# EAGLE design INA226 (EAGLE 7.1.0)
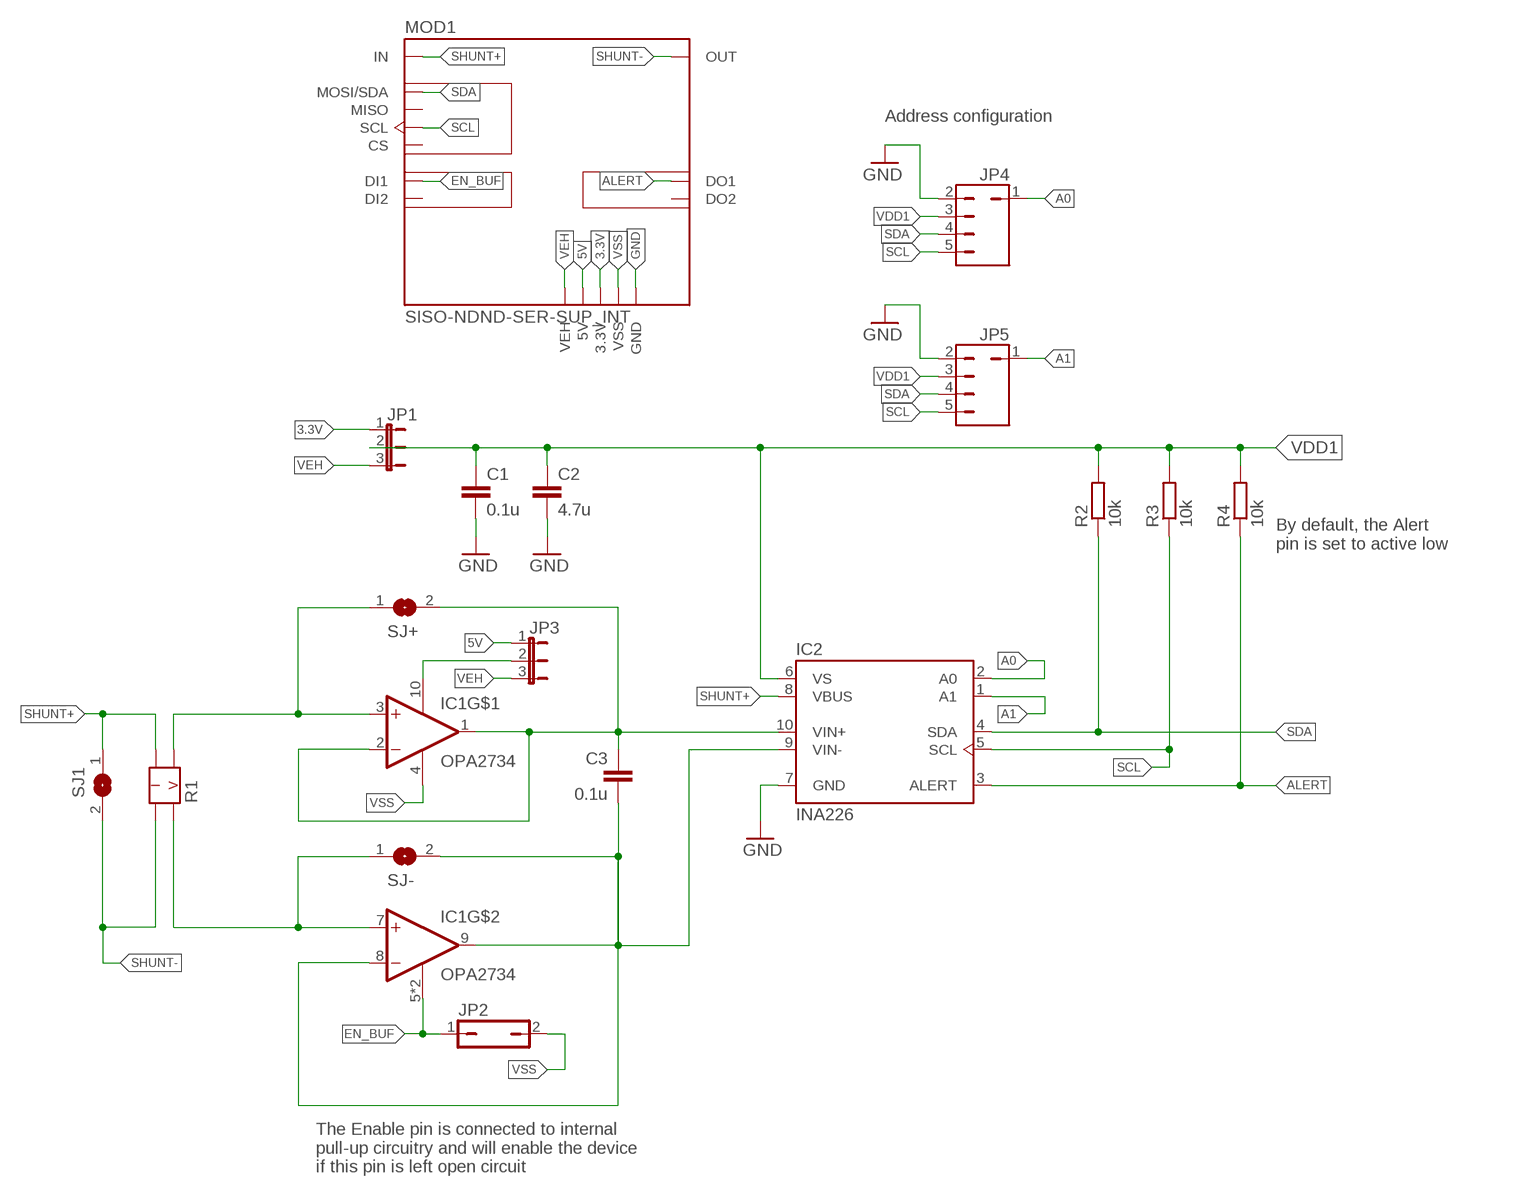
[diagram p0: schematic, sheet 1]

## Parts
C1  0.1u  C-EUC0805K  [C0805K]
C2  4.7u  C-EUC1206K  [C1206K]
C3  0.1u  C-EUC0805K  [C0805K]
IC1  OPA2734  [MSOP10]
IC2  INA226  [DGS10]
JP1  JP2E  [JP2]
JP2  JP1Q  [JP1]
JP3  JP2E  [JP2]
JP4  JP3Q  [JP1-4]
JP5  JP3Q  [JP1-4]
MOD1  SISO-NDND-SER-SUP_INT  [SISO-NDND-SER-SUP]
R1  LVK_SERIESR1206  [LVK12]
R2  10k  R-EU_R0805  [R0805]
R3  10k  R-EU_R0805  [R0805]
R4  10k  R-EU_R0805  [R0805]
SJ1  SJ  [SJ]
SJ+  SJ2  [SJ2]
SJ-  SJ2  [SJ2]

## Nets
3.3V: JP1.1 MOD1.3.3V
5V: JP3.1 MOD1.5V
A0: IC2.2(A0) JP4.1
A1: IC2.1(A1) JP5.1
ALERT: IC2.3(ALERT) MOD1.DO1 R4.1
EN_BUF: IC1.5(EN$1) IC1.6(EN$1) JP2.1 MOD1.DI1
GND: C1.2 C2.2 IC2.7(GND) JP4.2 JP5.2 MOD1.GND1(GND) MOD1.GND2(GND) MOD1.GND3(GND) MOD1.GND4(GND)
N$2: IC1.3(+IN) R1.V2 SJ+.1
N$4: IC1.10(V+) JP3.2
N$7: IC1.7(+IN) R1.V1 SJ-.1
OUT_A: C3.1 IC1.1(OUT) IC1.2(-IN) IC2.10(VIN+) SJ+.2
OUT_B: C3.2 IC1.8(-IN) IC1.9(OUT) IC2.9(VIN-) SJ-.2
SCL: IC2.5(SCL) JP4.5 JP5.5 MOD1.SCL R3.1
SDA: IC2.4(SDA) JP4.4 JP5.4 MOD1.MOSI/SDA R2.1
SHUNT+: IC2.8(VBUS) MOD1.IN1(IN) MOD1.IN2(IN) MOD1.IN3(IN) MOD1.IN4(IN) R1.I2 SJ1.1
SHUNT-: MOD1.OUT1(OUT) MOD1.OUT2(OUT) MOD1.OUT3(OUT) MOD1.OUT4(OUT) R1.I1 SJ1.2
VDD1: C1.1 C2.1 IC2.6(VS) JP1.2 JP4.3 JP5.3 R2.2 R3.2 R4.2
VEH: JP1.3 JP3.3 MOD1.VEH
VSS: IC1.4(V-) JP2.2 MOD1.VSS
Unconnected: MOD1.CS MOD1.DI2 MOD1.DO2 MOD1.MISO

## Notes on the sheet
- Address configuration
- By default, the Alert
  pin is set to active low
- The Enable pin is connected to internal
  pull-up circuitry and will enable the device
  if this pin is left open circuit

## Library data of the parts
C1-C3 = rcl:C-EU: CAPACITOR, European symbol
IC1 = OPA2734:OPA2734
IC2 = INA226:INA226
JP1 JP3 = Jumper_mod:JP2E: JUMPER
JP2 = jumper:JP1Q: JUMPER
JP4 JP5 = Jumper_mod:JP3Q: JUMPER
MOD1 = AllModules:SISO-NDND-SER-SUP_INT
R1 = LVK_Series:LVK_SERIES: RESISTOR, European symbol; SPICEPREFIX: R
R2-R4 = rcl:R-EU_: RESISTOR, European symbol
SJ1 = jumper:SJ: SMD solder JUMPER
SJ+ SJ- = Jumper_mod:SJ2: SMD solder JUMPER

## Board
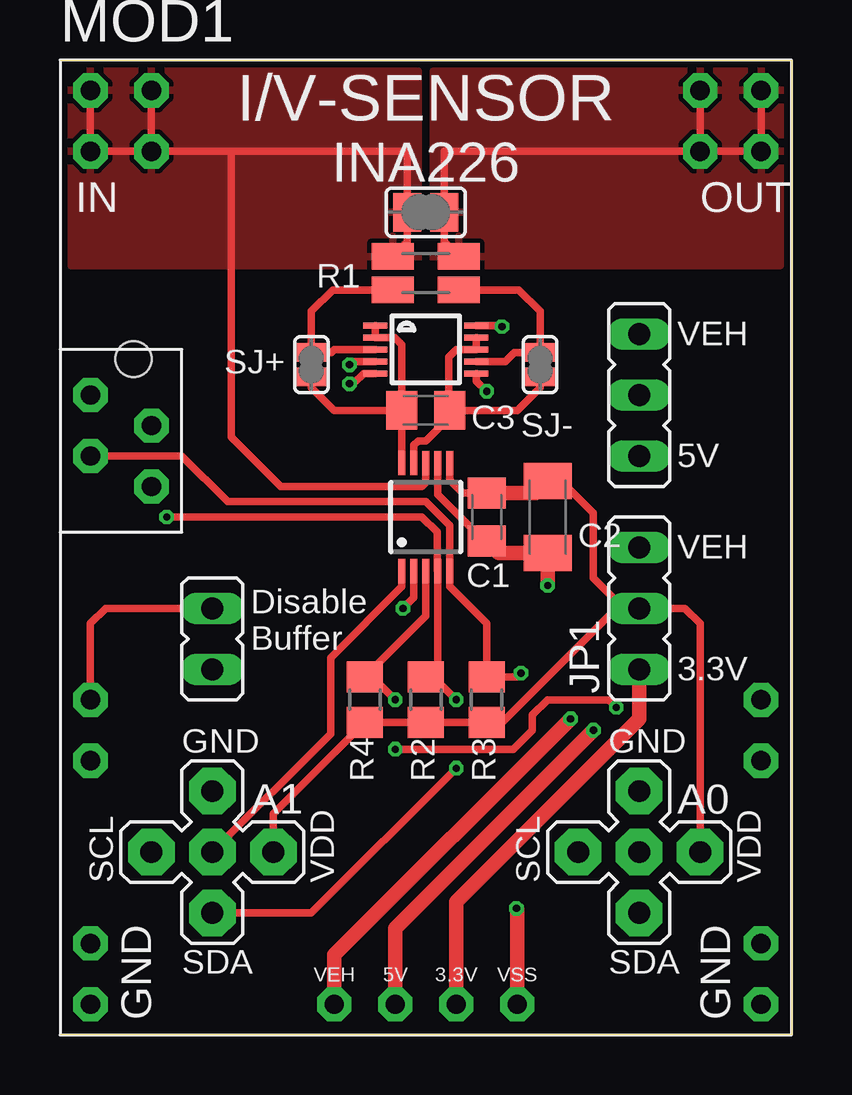
[diagram p1: board, top side]
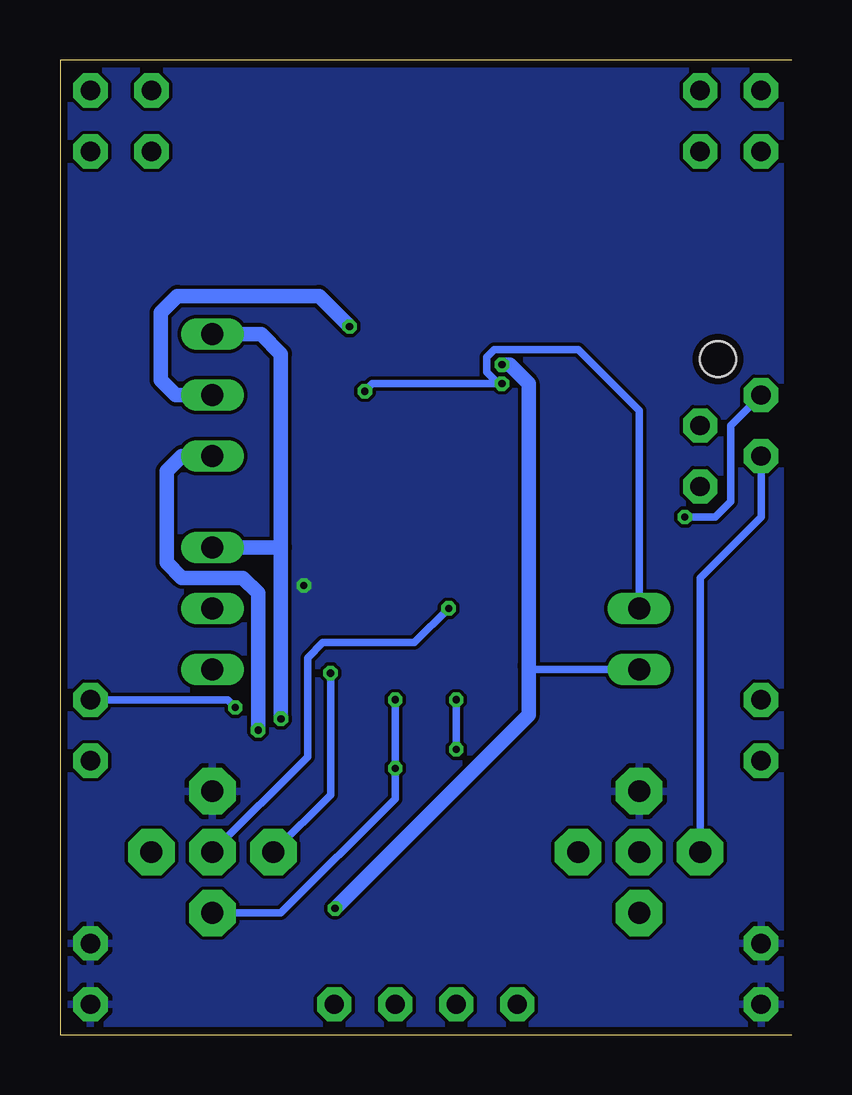
[diagram p2: board, bottom side, seen from below]

Size 30.48 x 40.64 mm. Coordinates in mm from the lower left corner, seen from the top.
Outline: 0,40.64 30.48,40.64 30.48,0 0,0
Copper layers (1*16): Top 0.035mm / dielectric 1.5mm / Bottom 0.035mm
Design rules "PCB-POOL Standard": minimum track width 0.15mm, minimum drill 0.3mm, track to track 0.15mm, track to pad 0.15mm, pad to pad 0.15mm, via to via 0.15mm, smd to smd 0.15mm, copper to edge 0.3mm, drill to drill 0.2mm, minimum pad ring 0.2mm, minimum via ring 0.15mm, stop-mask expansion 0.075mm, vias tented up to drill 0mil, thermal gap 0.2mm

### Footprints (pad centres in the part's own frame; a part is rotated, then mirrored left to right if it is on the bottom)
C0805K = smd 1.3 x 1.6: 1 -1,0; 2 1,0
C1206K = smd 1.5 x 2: 1 -1.5,0; 2 1.5,0
MSOP10 = smd 0.25 x 1: 1 -1,-2.113; 2 -0.5,-2.113; 3 0,-2.113; 4 0.5,-2.113; 5 1,-2.113; 6 1,2.113; 7 0.5,2.113; 8 0,2.113; 9 -0.5,2.113; 10 -1,2.113
DGS10 = smd 0.3 x 1: 1 -1,-2.25; 2 -0.5,-2.25; 3 0,-2.25; 4 0.5,-2.25; 5 1,-2.25; 6 1,2.25; 7 0.5,2.25; 8 0,2.25; 9 -0.5,2.25; 10 -1,2.25
JP2 = drill 0.914 long: 1 -2.54,0; 2 0,0; 3 2.54,0
JP1 = drill 0.914 long: 1 0,-1.27; 2 0,1.27
JP1-4 = drill 0.914 pad 1.93 octagon: 1 0,0; 2 0,2.54; 3 2.54,0; 4 0,-2.54; 5 -2.54,0
SISO-NDND-SER-SUP = drill 0.8 pad 1.422 octagon: 3.3V 15.24,-38.1; 5V 12.7,-38.1; CS 2.54,-16.51; DI1 0,-25.4; DI2 0,-27.94; DO1 27.94,-25.4; DO2 27.94,-27.94; GND1 0,-38.1; GND2 0,-35.56; GND3 27.94,-35.56; GND4 27.94,-38.1; IN1 0,0; IN2 0,-2.54; IN3 2.54,0; IN4 2.54,-2.54; MISO 2.54,-13.97; MOSI/SDA 0,-12.7; OUT1 25.4,0; OUT2 25.4,-2.54; OUT3 27.94,0; OUT4 27.94,-2.54; SCL 0,-15.24; VEH 10.16,-38.1; VSS 17.78,-38.1 | hole 1.5: 1.8,-11.2
LVK12 = smd 1.75 x 1.1: I1 -1.378,-0.7; I2 1.372,-0.7; V1 -1.378,0.7; V2 1.372,0.7
R0805 = smd 1.3 x 1.5: 1 -0.95,0; 2 0.95,0
SJ = smd 1.168 x 1.6: 1 -0.762,0; 2 0.762,0
SJ2 = smd 0.762 x 1.27: 1 -0.508,0; 2 0.508,0

### Placement (x,y rotation side)
C1  17.78,21.59 270 top
C2  20.32,21.59 270 top
C3  15.24,26.04 0 top
IC1  15.24,28.58 270 top
IC2  15.24,21.59 0 top
JP1  24.13,17.78 90 top
JP2  6.35,16.51 180 top
JP3  24.13,26.67 90 top
JP4  24.13,7.62 0 top
JP5  6.35,7.62 0 top
MOD1  1.27,39.37 0 top
R1  15.24,31.75 180 top
R2  15.24,13.97 270 top
R3  17.78,13.97 270 top
R4  12.7,13.97 270 top
SJ1  15.24,34.29 0 top
SJ+  10.48,27.94 270 top
SJ-  20,27.94 270 top

### Tracks (layer width: path | path; a pad name or v marks a point on that pad's centre or on a via)
3.3V
  Top 0.61: MOD1.3.3V 16.51,5.56 24.13,13.18 JP1.1
5V  (via drill 0.3)
  Top 0.61: v22.23,12.7 13.97,4.45 MOD1.5V
  Bottom 0.61: v22.23,12.7 22.23,18.41 22.86,19.05 25.4,19.05 26.04,19.69 26.04,23.5 25.4,24.13 JP3.1
A0  (via drill 0.3)
  Top 0.305: IC2.2 14.74,18.23 v14.29,17.78
  Bottom 0.305: v14.29,17.78 15.72,16.35 19.53,16.35 20.16,15.72 20.16,11.59 JP4.1
A1
  Top 0.305: IC2.1 14.24,18.69 11.27,15.72 11.27,12.54 JP5.1
ALERT  (via drill 0.3)
  Top 0.305: IC2.3 15.24,17.46 R4.1 13.02,14.92 v13.97,13.97 | v13.97,11.91 18.89,11.91 19.68,12.7 19.68,13.34 20.32,13.97 22.86,13.97 v23.18,13.65
  Bottom 0.305: v13.97,11.91 v13.97,13.97 | v23.18,13.65 23.5,13.97 MOD1.DO1
EN_BUF  (via drill 0.3)
  Top 0.305: IC1.5 12.65,27.58 12.22,27.15 v12.06,27.15 | IC1.6 17.35,27.26 v17.78,26.83 | JP2.1 1.91,17.78 1.27,17.14 MOD1.DI1
  Bottom 0.305: v17.78,26.83 17.46,27.15 v12.06,27.15 12.22,27.15 12.7,27.62 12.7,28.26 12.38,28.58 8.89,28.58 6.35,26.04 JP2.1
GND  (via drill 0.3)
  Top 0.305: C1.2 17.41,20.96 17.3,20.96 15.74,22.52 IC2.7 | 19.82,20.59 C2.2
  Top 0.61: C1.2 18.28,20.09 C2.2 v20.32,18.73
  pour Bottom: 0.48,40.16 0.48,0.48 30,0.48 30,40.16
  pour Bottom: 30,4.92 28.26,4.92 28.26,0.48 30,0.48
  pour Bottom: 0.48,4.76 0.48,0.48 2.22,0.48 2.22,4.76
N$2
  Top 0.305: R1.V2 11.37,31.05 10.48,30.16 SJ+.1 | 10.29,28.58 SJ+.1 | IC1.3 11.43,28.58 11.3,28.45 SJ+.1
N$4  (via drill 0.3)
  Top 0.305: v18.41,29.53 18.37,29.58 IC1.10
  Bottom 0.61: JP3.2 25.65,26.67 26.29,27.3 26.29,30.1 25.59,30.8 19.68,30.8 v18.41,29.53
N$7
  Top 0.305: R1.V1 19.11,31.05 20,30.16 SJ-.1 18.92,28.45 18.55,28.08 IC1.7
OUT_A
  Top 0.305: IC2.10 C3.1 | IC1.1 IC1.2 13.95,29.08 14.24,28.78 C3.1 | C3.1 11.43,26.04 10.48,26.99 SJ+.2
OUT_B
  Top 0.305: IC2.9 14.74,24.58 14.92,24.77 15.24,24.77 16.24,25.77 C3.2 | IC1.9 IC1.8 16.51,28.58 16.19,28.26 16.19,26.08 C3.2 | C3.2 19.05,26.04 20,26.99 SJ-.2
SCL  (via drill 0.3)
  Top 0.305: MOD1.SCL 5.08,24.13 6.99,22.23 15.24,22.23 16.24,21.23 IC2.5 16.24,18.69 17.78,17.14 R3.1 19.21,14.92 v19.21,15.08
  Bottom 0.305: MOD1.SCL 1.27,21.59 3.81,19.05 JP5.5 | v19.21,15.08 19.21,10 JP4.5
SDA  (via drill 0.3)
  Top 0.305: JP5.4 10.48,5.08 v16.51,11.11 | v16.51,13.97 15.56,14.92 R2.1 15.74,15.42 IC2.4 15.72,19.36 15.72,20.96 15.08,21.59 v4.45,21.59
  Bottom 0.305: v16.51,13.97 v16.51,11.11 16.51,9.84 21.27,5.08 JP4.4 | MOD1.MOSI/SDA 2.54,25.4 2.54,22.23 3.17,21.59 v4.45,21.59
SHUNT+
  Top 0.305: MOD1.IN1 MOD1.IN2 MOD1.IN4 | MOD1.IN3 MOD1.IN4 | R1.I2 14.48,33.06 SJ1.1 14.48,36.83 7.14,36.83 | MOD1.IN4 7.14,36.83 | IC2.8 15.24,23.02 15.08,22.86 9.21,22.86 7.14,24.92 7.14,36.83
  pour Top: 14.92,32.07 0.48,32.07 0.48,40.16 14.92,40.16
SHUNT-
  Top 0.305: MOD1.OUT2 16,36.83 SJ1.2 16,33.07 R1.I1 | MOD1.OUT3 MOD1.OUT4 MOD1.OUT2 | MOD1.OUT1 MOD1.OUT2
  pour Top: 15.56,32.07 15.56,40.16 30,40.16 30,32.07
VDD1
  Top 0.305: JP5.3 8.89,9.21 R4.2 R2.2 R3.2 18.42,13.02 23.18,17.78 JP1.2 | IC2.6 16.24,23.13 16.78,22.59 C1.1 | JP4.3 26.67,17.14 26.04,17.78 JP1.2 | JP1.2 23.5,17.78 22.23,19.05 22.23,21.75 20.88,23.09
  Top 0.61: 20.88,23.09 C2.1 19.82,22.59 C1.1
VEH  (via drill 0.3)
  Top 0.61: MOD1.VEH 11.43,3.33 v21.27,13.18
  Bottom 0.61: v21.27,13.18 21.27,20.32 | 21.27,20.32 21.27,28.38 22.1,29.21 JP3.3 | JP1.3 21.27,20.32
VSS  (via drill 0.3)
  Top 0.305: v12.06,27.94 12.2,28.08 IC1.4
  Top 0.61: v19.02,5.27 19.05,5.24 MOD1.VSS
  Bottom 0.305: JP2.2 10.79,15.24 10.95,15.4
  Bottom 0.61: v12.06,27.94 11.75,27.94 10.95,27.15 10.95,15.4 10.95,13.34 v19.02,5.27

### Text on the board
tNames: I/V-SENSOR | INA226 | VEH | 5V | VEH | Disable / Buffer | 3.3V | GND | GND | A1 | A0 | SCL | VDD | SCL | VDD | SDA | SDA
bStop: by Jan Kokert / 25.04.2017